# Altium project HLK-TX510_2.8_KIT_V1.1.PRJPCB
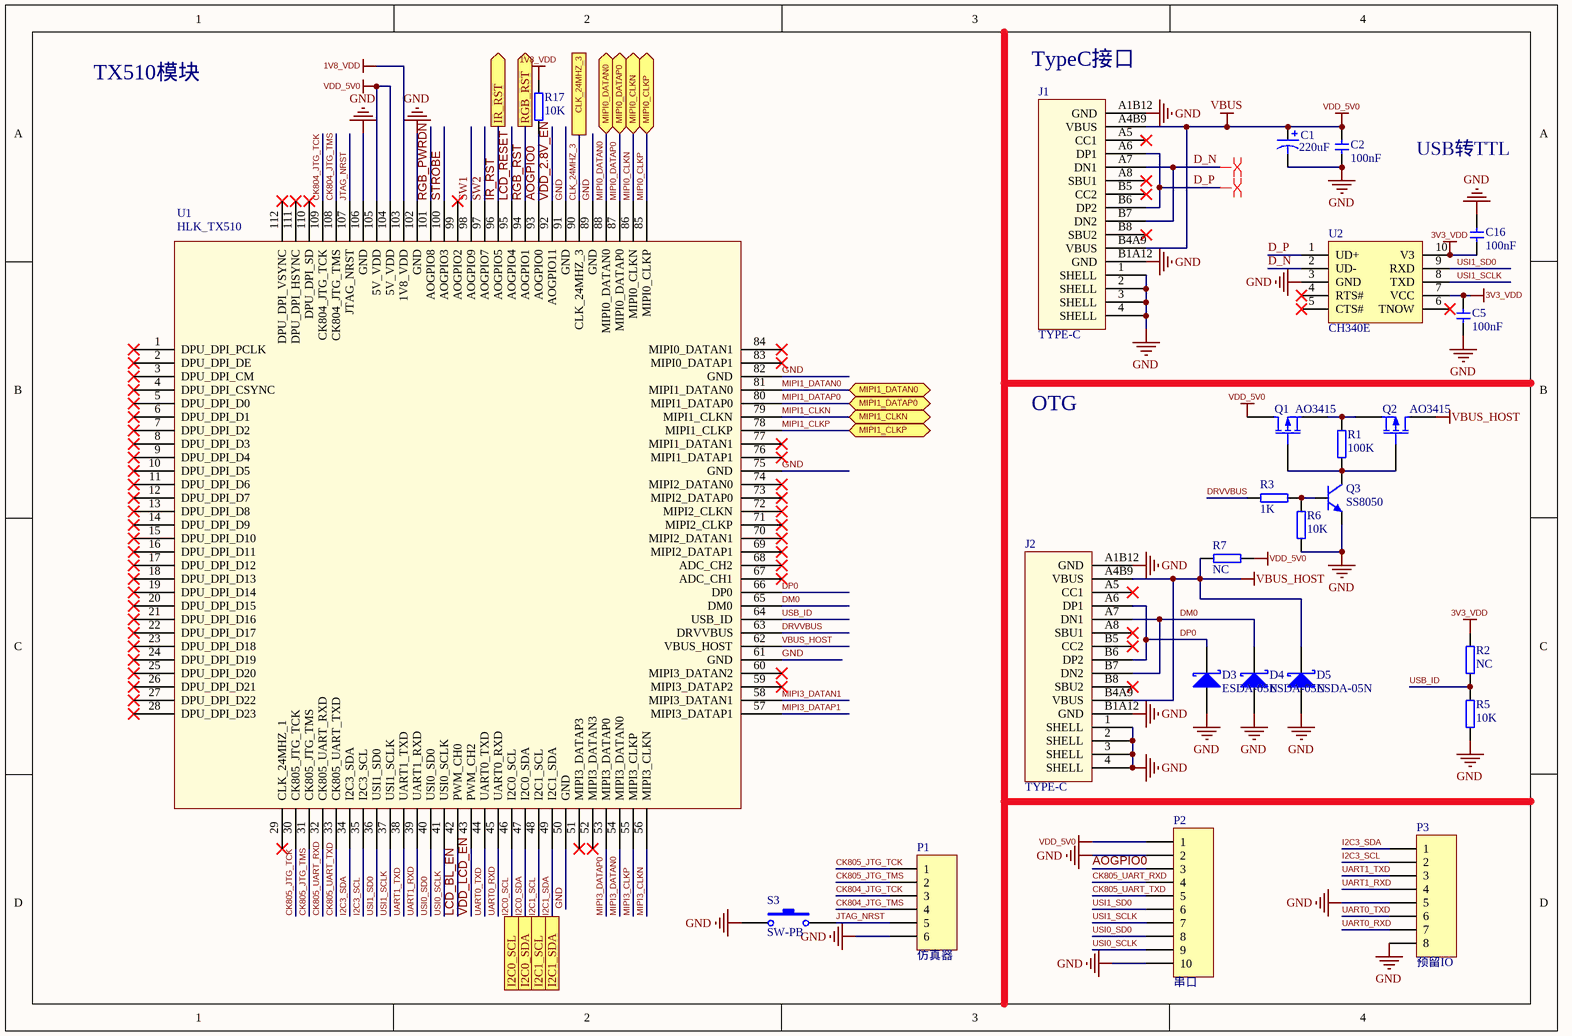
[diagram p0: 1-TX510_KIT.SchDoc]
2 sheets, 97 parts. Net scope: global (net labels, ports and power ports of the same name join across sheets).
Board file: HLK-TX510_2.8_KIT_V1.1.PcbDoc
Sheets:
  1-TX510_KIT.SchDoc
  2-LCD&CAMERA.SchDoc

## Sheet 1-TX510_KIT.SchDoc: HD-S16-MB-V1.0
size A4

### Parts
C1  value 220uF  [SMD,6.3x7.7mm]  (hidden comment: Cap Pol1)
C2  100nF  [C0402]
C5  100nF  [C0402]
C16  100nF  [C0402]
D3  ESDA-05N  [R0402]
D4  ESDA-05N  [R0402]
D5  ESDA-05N  [R0402]
J1  TYPE-C  [TYPE-C16PIN]
J2  TYPE-C  [TYPE-C16PIN]
P1  仿真器  [HDR1X6]
P2  串口  [HDR1X10]
P3  预留IO  [HDR1X8]
Q1  AO3415  [SOT-23]
Q2  AO3415  [SOT-23]
Q3  SS8050  [SOT23-BEC]
R1  100K  [R0402]
R2  NC  [R0402]
R3  1K  [R0402]
R5  10K  [R0402]
R6  10K  [R0402]
R7  NC  [RES_0603]
R17  10K  [R0402]
S3  SW-PB  [轻触开关4.5x4.5]
U1  HLK_TX510  [HLK_TX510 _KIT]
U2  CH340E  [MSOP-10]

### Ports
CLK_24MHZ_3, I2C0_SCL, I2C0_SDA, I2C1_SCL, I2C1_SDA, IR_RST (out), MIPI0_CLKN (bidir), MIPI0_CLKP (bidir), MIPI0_DATAN0 (bidir), MIPI0_DATAP0 (bidir), MIPI1_CLKN (bidir), MIPI1_CLKP (bidir), MIPI1_DATAN0 (bidir), MIPI1_DATAP0 (bidir), RGB_RST (out)

### Nets
1V8_VDD: R17.2 U1.103(1V8_VDD)
3V3_VDD: C5.2 C16.1 R2.2 U2.7(VCC) U2.10(V3)
GND: C1.2 C2.1 C5.1 C16.2 D3.1(A) D4.1(A) D5.1(A) J1.1(SHELL) J1.2(SHELL) J1.3(SHELL) J1.4(SHELL) J1.A1B12(GND) J1.B1A12(GND) J2.1(SHELL) J2.2(SHELL) J2.3(SHELL) J2.4(SHELL) J2.A1B12(GND) J2.B1A12(GND) P1.6 P2.2 P2.10 P3.5 P3.8 Q3.E R5.1 R6.1 S3.1 U1.50(GND) U1.61(GND) U1.75(GND) U1.82(GND) U1.89(GND) U1.91(GND) U1.102(GND) U1.106(GND) U2.3(GND)
VBUS: C1.1 C2.2 J1.A4B9(VBUS) J1.B4A9(VBUS) P2.1 Q1.3(D) R7.1 U1.104(5V_VDD) U1.105(5V_VDD)  [also labelled VDD_5V0]
VBUS_HOST: D5.2(K) J2.A4B9(VBUS) J2.B4A9(VBUS) Q2.3(D) R7.2 U1.62(VBUS_HOST)
AOGPIO0: P2.3 R17.1 U1.93(AOGPIO0)
CK804_JTG_TCK: P1.3 U1.109(CK804_JTG_TCK)
CK804_JTG_TMS: P1.4 U1.108(CK804_JTG_TMS)
CK805_JTG_TCK: P1.1 U1.30(CK805_JTG_TCK)
CK805_JTG_TMS: P1.2 U1.31(CK805_JTG_TMS)
CK805_UART_RXD: P2.4 U1.32(CK805_UART_RXD)
CK805_UART_TXD: P2.5 U1.33(CK805_UART_TXD)
CLK_24MHZ_3: U1.90(CLK_24MHZ_3) ; port CLK_24MHZ_3
D_N: J1.A7(DN1) J1.B7(DN2) U2.2(UD-)
D_P: J1.A6(DP1) J1.B6(DP2) U2.1(UD+)
DM0: D4.2(K) J2.A7(DN1) J2.B7(DN2) U1.65(DM0)
DP0: D3.2(K) J2.A6(DP1) J2.B6(DP2) U1.66(DP0)
DRVVBUS: R3.2 U1.63(DRVVBUS)
I2C0_SCL: U1.46(I2C0_SCL) ; port I2C0_SCL
I2C0_SDA: U1.47(I2C0_SDA) ; port I2C0_SDA
I2C1_SCL: U1.48(I2C1_SCL) ; port I2C1_SCL
I2C1_SDA: U1.49(I2C1_SDA) ; port I2C1_SDA
I2C3_SCL: P3.2 U1.35(I2C3_SCL)
I2C3_SDA: P3.1 U1.34(I2C3_SDA)
IR_RST: U1.96(AOGPIO5) ; port IR_RST
JTAG_NRST: P1.5 S3.2 U1.107(JTAG_NRST)
LCD_BL_EN: U1.42(PWM_CH0)
LCD_RESET: U1.95(AOGPIO4)
MIPI0_CLKN: U1.86(MIPI0_CLKN) ; port MIPI0_CLKN
MIPI0_CLKP: U1.85(MIPI0_CLKP) ; port MIPI0_CLKP
MIPI0_DATAN0: U1.88(MIPI0_DATAN0) ; port MIPI0_DATAN0
MIPI0_DATAP0: U1.87(MIPI0_DATAP0) ; port MIPI0_DATAP0
MIPI1_CLKN: U1.79(MIPI1_CLKN) ; port MIPI1_CLKN
MIPI1_CLKP: U1.78(MIPI1_CLKP) ; port MIPI1_CLKP
MIPI1_DATAN0: U1.81(MIPI1_DATAN0) ; port MIPI1_DATAN0
MIPI1_DATAP0: U1.80(MIPI1_DATAP0) ; port MIPI1_DATAP0
MIPI3_CLKN: U1.56(MIPI3_CLKN)
MIPI3_CLKP: U1.55(MIPI3_CLKP)
MIPI3_DATAN0: U1.54(MIPI3_DATAN0)
MIPI3_DATAN1: U1.58(MIPI3_DATAN1)
MIPI3_DATAP0: U1.53(MIPI3_DATAP0)
MIPI3_DATAP1: U1.57(MIPI3_DATAP1)
RGB_PWRDN: U1.101(AOGPIO8)
RGB_RST: U1.94(AOGPIO1) ; port RGB_RST
STROBE: U1.100(AOGPIO3)
SW1: U1.98(AOGPIO9)
SW2: U1.97(AOGPIO7)
UART0_RXD: P3.7 U1.45(UART0_RXD)
UART0_TXD: P3.6 U1.44(UART0_TXD)
UART1_RXD: P3.4 U1.39(UART1_RXD)
UART1_TXD: P3.3 U1.38(UART1_TXD)
USB_ID: R2.1 R5.2 U1.64(USB_ID)
USI0_SCLK: P2.9 U1.41(USI0_SCLK)
USI0_SD0: P2.8 U1.40(USI0_SD0)
USI1_SCLK: P2.7 U1.37(USI1_SCLK) U2.8(TXD)
USI1_SD0: P2.6 U1.36(USI1_SD0) U2.9(RXD)
VDD_2.8V_EN: U1.92(AOGPIO11)
VDD_LCD_EN: U1.43(PWM_CH2)
NetQ1_1: Q1.1(G) Q2.1(G) Q3.C R1.1
NetQ1_2: Q1.2(S) Q2.2(S) R1.2
NetQ3_B: Q3.B R3.1 R6.2

Not connected (* = marked no-connect by the designer): J1 A5(CC1)* A8(SBU1)* B5(CC2)* B8(SBU2)*; J2 A5(CC1)* A8(SBU1)* B5(CC2)* B8(SBU2)*; U1 1(DPU_DPI_PCLK)* 2(DPU_DPI_DE)* 3(DPU_DPI_CM)* 4(DPU_DPI_CSYNC)* 5(DPU_DPI_D0)* 6(DPU_DPI_D1)* 7(DPU_DPI_D2)* 8(DPU_DPI_D3)* 9(DPU_DPI_D4)* 10(DPU_DPI_D5)* 11(DPU_DPI_D6)* 12(DPU_DPI_D7)* 13(DPU_DPI_D8)* 14(DPU_DPI_D9)* 15(DPU_DPI_D10)* 16(DPU_DPI_D11)* 17(DPU_DPI_D12)* 18(DPU_DPI_D13)* 19(DPU_DPI_D14)* 20(DPU_DPI_D15)* 21(DPU_DPI_D16)* 22(DPU_DPI_D17)* 23(DPU_DPI_D18)* 24(DPU_DPI_D19)* 25(DPU_DPI_D20)* 26(DPU_DPI_D21)* 27(DPU_DPI_D22)* 28(DPU_DPI_D23)* 29(CLK_24MHZ_1)* 51(MIPI3_DATAP3)* 52(MIPI3_DATAN3)* 59(MIPI3_DATAP2)* 60(MIPI3_DATAN2)* 67(ADC_CH1)* 68(ADC_CH2)* 69(MIPI2_DATAP1)* 70(MIPI2_DATAN1)* 71(MIPI2_CLKP)* 72(MIPI2_CLKN)* 73(MIPI2_DATAP0)* 74(MIPI2_DATAN0)* 76(MIPI1_DATAP1)* 77(MIPI1_DATAN1)* 83(MIPI0_DATAP1)* 84(MIPI0_DATAN1)* 99(AOGPIO2)* 110(DPU_DPI_SD)* 111(DPU_DPI_HSYNC)* 112(DPU_DPI_VSYNC)*; U2 4(RTS#)* 5(CTS#)* 6(TNOW)*

### Layout directives
differential pair: D_N, D_P

### Notes on the sheet
- TX510模块
- (near J1) TypeC接口
- USB转TTL
- OTG

### Library data of the parts
C1 = Cap Pol1: Polarized Capacitor (Radial); Published: 8-Jun-2000; LatestRevisionDate: 17-Jul-2002; LatestRevisionNote: Re-released for DXP Platform.; PackageReference: RB7.6-15; Publisher: Altium Limited
C2 C5 C16 = CAP1: C?
D3-D5 = Diode BAS70: Silicon AF Schottky Diode for High-Speed Switching; Note: Pin 2 is not connected and not drawn.; Published: 21-Mar-2003; DatasheetDocument: Oct-1999; PackageDocument: Sep-2001; PackageReference: SOT-23; Publisher: Altium Limited; ComponentLink1Description: Manufacturer Link; ComponentLink1URL: http://www.infineon.com/; ComponentLink2Description: Datasheet; ComponentLink2URL: http://www.infineon.com/upload/Document/cmc_upload/documents/009/382/bas40_bas140series_1.pdf
J1 J2 = TYPE-C16PIN
P1 = Header 6: Header, 6-Pin; LatestRevisionDate: 17-Jul-2002; LatestRevisionNote: Re-released for DXP Platform.; Publisher: Altium Limited
P2 = Header 10: Header, 10-Pin; LatestRevisionDate: 17-Jul-2002; LatestRevisionNote: Re-released for DXP Platform.; Publisher: Altium Limited
P3 = Header 8: Header, 8-Pin; LatestRevisionDate: 17-Jul-2002; LatestRevisionNote: Re-released for DXP Platform.; Publisher: Altium Limited
Q3 = NPN: 贴片三极管
R1-R3 R5-R7 R17 = RES1: R?
S3 = SW-PB: Switch; Published: 24-Mar-1999; LatestRevisionDate: 17-Jul-2002; LatestRevisionNote: Re-released for DXP Platform.; PackageReference: SPST-2; Publisher: Altium Limited; PackageDescription: Switch; 2 Leads

## Sheet 2-LCD&CAMERA.SchDoc: HD-S16-MB-V1.0
size A4
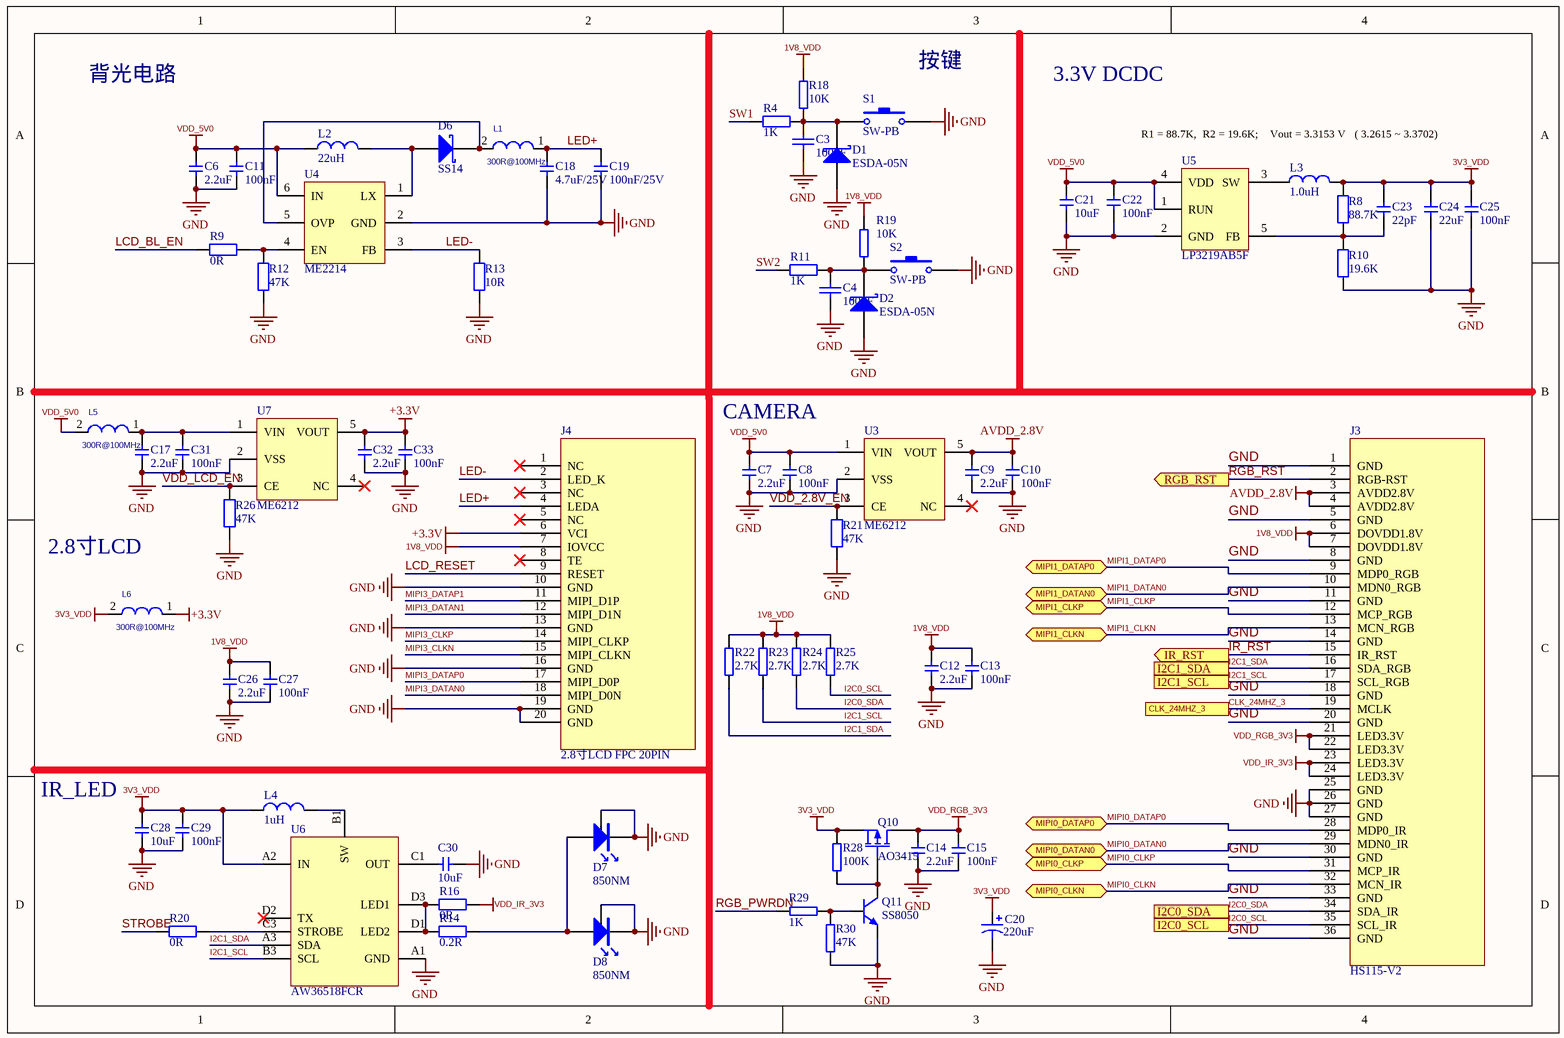
[diagram p1: 2-LCD&CAMERA.SchDoc]

### Parts
C3  100nF  [C0402]
C4  100nF  [C0402]
C6  2.2uF  [C0402]
C7  2.2uF  [C0402]
C8  100nF  [C0402]
C9  2.2uF  [C0402]
C10  100nF  [C0402]
C11  100nF  [C0402]
C12  2.2uF  [C0402]
C13  100nF  [C0402]
C14  2.2uF  [C0402]
C15  100nF  [C0402]
C17  2.2uF  [C0402]
C18  4.7uF/25V  [Cap_0603]
C19  100nF/25V  [C0402]
C20  value 220uF  [SMD,6.3x7.7mm]  (hidden comment: Cap Pol1)
C21  10uF  [Cap_0603]
C22  100nF  [C0402]
C23  22pF  [C0402]
C24  22uF  [CAP_0603]
C25  100nF  [C0402]
C26  2.2uF  [C0402]
C27  100nF  [C0402]
C28  10uF  [C0402]
C29  100nF  [C0402]
C30  10uF  [C0402]
C31  100nF  [C0402]
C32  2.2uF  [C0402]
C33  100nF  [C0402]
D1  ESDA-05N  [R0402]
D2  ESDA-05N  [R0402]
D6  SS14  [SOD-123F]
D7  850NM  [LED-3535-850MM]
D8  850NM  [LED-3535-850MM]
J3  HS115-V2  [0.5-36PIN]
J4  2.8寸LCD FPC 20PIN  [0.5-20PIN-抽屉上接]
L1  300R@100MHz  [Res_0603]
L2  22uH  [L3*3]
L3  1.0uH  [L2.5x2.0x1.0mm]
L4  1uH  [L2.5x2.0x1.0mm]
L5  300R@100MHz  [Res_0603]
L6  300R@100MHz  [Res_0603]
Q10  AO3415  [SOT-23]
Q11  SS8050  [SOT23-BEC]
R4  1K  [R0402]
R8  88.7K  [R0402]
R9  0R  [R0402]
R10  19.6K  [R0402]
R11  1K  [R0402]
R12  47K  [R0402]
R13  10R  [R0805]
R14  0.2R  [R0805]
R16  0R  [R0805]
R18  10K  [R0402]
R19  10K  [R0402]
R20  0R  [R0402]
R21  47K  [R0402]
R22  2.7K  [R0402]
R23  2.7K  [R0402]
R24  2.7K  [R0402]
R25  2.7K  [R0402]
R26  47K  [R0402]
R28  100K  [R0402]
R29  1K  [R0402]
R30  47K  [R0402]
S1  SW-PB  [轻触开关4.5x4.5]
S2  SW-PB  [轻触开关4.5x4.5]
U3  ME6212  [SOT23-5]
U4  ME2214  [SOT26]
U5  LP3219AB5F  [SOT23-5]
U6  AW36518FCR  [FCQFN-10L]
U7  ME6212  [SOT23-5]

### Ports
CLK_24MHZ_3, I2C0_SCL, I2C0_SDA, I2C1_SCL, I2C1_SDA, IR_RST (out), MIPI0_CLKN (bidir), MIPI0_CLKP (bidir), MIPI0_DATAN0 (bidir), MIPI0_DATAP0 (bidir), MIPI1_CLKN (bidir), MIPI1_CLKP (bidir), MIPI1_DATAN0 (bidir), MIPI1_DATAP0 (bidir), RGB_RST (out)

### Nets
1V8_VDD: C12.1 C13.1 C26.1 C27.1 J3.6(DOVDD1.8V) J3.7(DOVDD1.8V) J4.7(IOVCC) R18.2 R19.2 R22.1 R23.1 R24.1 R25.1
3V3_VDD: C20.1 C23.2 C24.1 C25.1 C28.1 C29.1 L3.2 L4.1 L6.2 Q10.2(S) R8.2 R28.2 U6.A2(IN)
+3.3V: C32.1 C33.1 J4.6(VCI) L6.1 U7.5(VOUT)
AVDD_2.8V: C9.1 C10.1 J3.3(AVDD2.8V) J3.4(AVDD2.8V) U3.5(VOUT)
GND: C3.2 C4.2 C6.2 C7.2 C8.2 C9.2 C10.2 C11.2 C12.2 C13.2 C14.2 C15.2 C17.2 C18.2 C19.2 C20.2 C21.2 C22.2 C24.2 C25.2 C26.2 C27.2 C28.2 C29.2 C30.2 C31.2 C32.2 C33.2 D1.1(A) D2.1(A) D7.0 D7.K D8.0 D8.K J3.1(GND) J3.5(GND) J3.8(GND) J3.11(GND) J3.14(GND) J3.18(GND) J3.20(GND) J3.25(GND) J3.26(GND) J3.27(GND) J3.30(GND) J3.33(GND) J3.36(GND) J4.10(GND) J4.13(GND) J4.16(GND) J4.19(GND) J4.20(GND) Q11.E R10.2 R12.1 R13.2 R21.1 R26.1 R30.2 S1.2 S2.2 U3.2(VSS) U4.2(GND) U5.2(GND) U6.A1(GND) U7.2(VSS)
VDD_5V0: C6.1 C7.1 C8.1 C11.1 C21.1 C22.1 L2.1 L5.2 U3.1(VIN) U4.6(IN) U5.1(RUN) U5.4(VDD)  [project net VBUS]
VDD_IR_3V3: J3.23(LED3.3V) J3.24(LED3.3V) R16.2
VDD_RGB_3V3: C14.1 C15.1 J3.21(LED3.3V) J3.22(LED3.3V) Q10.3(D)
CLK_24MHZ_3: J3.19(MCLK) ; port CLK_24MHZ_3
I2C0_SCL: J3.35(SCL_IR) R25.2 ; port I2C0_SCL
I2C0_SDA: J3.34(SDA_IR) R24.2 ; port I2C0_SDA
I2C1_SCL: J3.17(SCL_RGB) R23.2 U6.B3(SCL) ; port I2C1_SCL
I2C1_SDA: J3.16(SDA_RGB) R22.2 U6.A3(SDA) ; port I2C1_SDA
IR_RST: J3.15(IR_RST) ; port IR_RST
LCD_BL_EN: R9.1
LCD_RESET: J4.9(RESET)
LED+: C18.1 C19.1 J4.4(LEDA) L1.1
LED-: J4.2(LED_K) R13.1 U4.3(FB)
MIPI0_CLKN: J3.32(MCN_IR) ; port MIPI0_CLKN
MIPI0_CLKP: J3.31(MCP_IR) ; port MIPI0_CLKP
MIPI0_DATAN0: J3.29(MDN0_IR) ; port MIPI0_DATAN0
MIPI0_DATAP0: J3.28(MDP0_IR) ; port MIPI0_DATAP0
MIPI1_CLKN: J3.13(MCN_RGB) ; port MIPI1_CLKN
MIPI1_CLKP: J3.12(MCP_RGB) ; port MIPI1_CLKP
MIPI1_DATAN0: J3.10(MDN0_RGB) ; port MIPI1_DATAN0
MIPI1_DATAP0: J3.9(MDP0_RGB) ; port MIPI1_DATAP0
MIPI3_CLKN: J4.15(MIPI_CLKN)
MIPI3_CLKP: J4.14(MIPI_CLKP)
MIPI3_DATAN0: J4.18(MIPI_D0N)
MIPI3_DATAN1: J4.12(MIPI_D1N)
MIPI3_DATAP0: J4.17(MIPI_D0P)
MIPI3_DATAP1: J4.11(MIPI_D1P)
RGB_PWRDN: R29.2
RGB_RST: J3.2(RGB-RST) ; port RGB_RST
STROBE: R20.1
SW1: R4.1
SW2: R11.1
VDD_2.8V_EN: R21.2 U3.3(CE)
VDD_LCD_EN: R26.2 U7.3(CE)
NetC3_1: C3.1 D1.2(K) R4.2 R18.1 S1.1
NetC4_1: C4.1 D2.2(K) R11.2 R19.1 S2.1
NetC17_1: C17.1 C31.1 L5.1 U7.1(VIN)
NetC23_1: C23.1 R8.1 R10.1 U5.5(FB)
NetC30_1: C30.1 U6.C1(OUT)
NetD6_1: D6.1(A) L2.2 U4.1(LX)
NetD6_2: D6.2(K) L1.2 U4.5(OVP)
NetD7_A: D7.A D8.A R14.2
NetL3_1: L3.1 U5.3(SW)
NetL4_2: L4.2 U6.B1(SW)
NetQ10_1: Q10.1(G) Q11.C R28.1
NetQ11_B: Q11.B R29.1 R30.1
NetR9_2: R9.2 R12.2 U4.4(EN)
NetR14_1: R14.1 R16.1 U6.D1(LED2) U6.D3(LED1)
NetR20_2: R20.2 U6.C3(STROBE)

Not connected (* = marked no-connect by the designer): J4 1(NC)* 3(NC)* 5(NC)* 8(TE)*; U3 4(NC)*; U6 D2(TX)*; U7 4(NC)*

### Notes on the sheet
- 背光电路
- (near S1) 按键
- 3.3V DCDC
- R1 = 88.7K,  R2 = 19.6K;    Vout = 3.3153 V   ( 3.2615 ~ 3.3702)
- CAMERA
- 2.8寸LCD
- (near C28) IR_LED

### Library data of the parts
C3 C4 = Cap: Capacitor; 物料名称: 贴片电容; 物料编码: 3.01.04.0056
C6-C15 C17-C19 C21-C33 = CAP1: C?
C20 = Cap Pol1: Polarized Capacitor (Radial); Published: 8-Jun-2000; LatestRevisionDate: 17-Jul-2002; LatestRevisionNote: Re-released for DXP Platform.; PackageReference: RB7.6-15; Publisher: Altium Limited
D1 D2 D6 = Diode BAS70: as D3 on sheet 1-TX510_KIT; Published: 21-Mar-2003; DatasheetDocument: Oct-1999; PackageDocument: Sep-2001; PackageReference: SOT-23; Publisher: Altium Limited; ComponentLink1Description: Manufacturer Link; ComponentLink1URL: http://www.infineon.com/; ComponentLink2Description: Datasheet; ComponentLink2URL: http://www.infineon.com/upload/Document/cmc_upload/documents/009/382/bas40_bas140series_1.pdf
D7 D8 = LED_IR: 贴片LED，3535，红外850NM
J4 = 2.8寸LCD FPC 20PIN: 1-Lane MIPI
L1 L5 L6 = L/0402
L2-L4 = LineInductors: FootPrint: 0805
Q11 = NPN: 贴片三极管
R4 R8-R14 R16 R20 R21 R26 = Res2: Resistor; Published: 8-Jun-2000; LatestRevisionDate: 17-Jul-2002; LatestRevisionNote: Re-released for DXP Platform.; PackageReference: AXIAL-0.4; Publisher: Altium Limited
  R4 R11: Value: 1K
  R8: Value: 88.7K
  R9 R16 R20: Value: 0R
  R10: Value: 19.6K
  R12 R21 R26: Value: 47K
  R13: Value: 10R
  R14: Value: 0.2R
R18 R19 R22-R25 R28-R30 = RES1: R?
S1 S2 = SW-PB: Switch; Published: 24-Mar-1999; LatestRevisionDate: 17-Jul-2002; LatestRevisionNote: Re-released for DXP Platform.; PackageReference: SPST-2; Publisher: Altium Limited; PackageDescription: Switch; 2 Leads
U5 = TD6817

## Nets that join several sheets
1V8_VDD: 1-TX510_KIT (R17.2 U1.103), 2-LCD&CAMERA (13 pins)
3V3_VDD: 1-TX510_KIT (5 pins), 2-LCD&CAMERA (13 pins)
GND: 1-TX510_KIT (37 pins), 2-LCD&CAMERA (66 pins)
VBUS: 1-TX510_KIT (9 pins), 2-LCD&CAMERA (12 pins)
CLK_24MHZ_3: 1-TX510_KIT (U1.90), 2-LCD&CAMERA (J3.19)
I2C0_SCL: 1-TX510_KIT (U1.46), 2-LCD&CAMERA (J3.35 R25.2)
I2C0_SDA: 1-TX510_KIT (U1.47), 2-LCD&CAMERA (J3.34 R24.2)
I2C1_SCL: 1-TX510_KIT (U1.48), 2-LCD&CAMERA (J3.17 R23.2 U6.B3)
I2C1_SDA: 1-TX510_KIT (U1.49), 2-LCD&CAMERA (J3.16 R22.2 U6.A3)
IR_RST: 1-TX510_KIT (U1.96), 2-LCD&CAMERA (J3.15)
LCD_BL_EN: 1-TX510_KIT (U1.42), 2-LCD&CAMERA (R9.1)
LCD_RESET: 1-TX510_KIT (U1.95), 2-LCD&CAMERA (J4.9)
MIPI0_CLKN: 1-TX510_KIT (U1.86), 2-LCD&CAMERA (J3.32)
MIPI0_CLKP: 1-TX510_KIT (U1.85), 2-LCD&CAMERA (J3.31)
MIPI0_DATAN0: 1-TX510_KIT (U1.88), 2-LCD&CAMERA (J3.29)
MIPI0_DATAP0: 1-TX510_KIT (U1.87), 2-LCD&CAMERA (J3.28)
MIPI1_CLKN: 1-TX510_KIT (U1.79), 2-LCD&CAMERA (J3.13)
MIPI1_CLKP: 1-TX510_KIT (U1.78), 2-LCD&CAMERA (J3.12)
MIPI1_DATAN0: 1-TX510_KIT (U1.81), 2-LCD&CAMERA (J3.10)
MIPI1_DATAP0: 1-TX510_KIT (U1.80), 2-LCD&CAMERA (J3.9)
MIPI3_CLKN: 1-TX510_KIT (U1.56), 2-LCD&CAMERA (J4.15)
MIPI3_CLKP: 1-TX510_KIT (U1.55), 2-LCD&CAMERA (J4.14)
MIPI3_DATAN0: 1-TX510_KIT (U1.54), 2-LCD&CAMERA (J4.18)
MIPI3_DATAN1: 1-TX510_KIT (U1.58), 2-LCD&CAMERA (J4.12)
MIPI3_DATAP0: 1-TX510_KIT (U1.53), 2-LCD&CAMERA (J4.17)
MIPI3_DATAP1: 1-TX510_KIT (U1.57), 2-LCD&CAMERA (J4.11)
RGB_PWRDN: 1-TX510_KIT (U1.101), 2-LCD&CAMERA (R29.2)
RGB_RST: 1-TX510_KIT (U1.94), 2-LCD&CAMERA (J3.2)
STROBE: 1-TX510_KIT (U1.100), 2-LCD&CAMERA (R20.1)
SW1: 1-TX510_KIT (U1.98), 2-LCD&CAMERA (R4.1)
SW2: 1-TX510_KIT (U1.97), 2-LCD&CAMERA (R11.1)
VDD_2.8V_EN: 1-TX510_KIT (U1.92), 2-LCD&CAMERA (R21.2 U3.3)
VDD_LCD_EN: 1-TX510_KIT (U1.43), 2-LCD&CAMERA (R26.2 U7.3)